# Altium schematic sheet Controller_Board_Main.SchDoc: Controller Board Main
size Tabloid; Author: Kevin Chen, Aleksa, Yifei Li; DrawnBy: Kevin Chen, Yifei Li; Engineer: Kevin Chen, Yifei Li; Revision: 4.0; SheetNumber: 1; SheetTotal: 2; PageSetup: Record=PageOptions|CenterHorizontal=True|CenterVertical=True|PrintScale=0.64|XCorrection=1.00|YCorrection=1.00|PrintKind=1|BorderSize=5000000|LeftOffset=0|BottomOffset=0|Orientation=2|PaperLength=1000|PaperWidth=1000|Scale=100|PaperSource=7|PrintQuality=-3|MediaType=1|DitherType=10|PrintScaleMode=1|PaperKind=Letter|PaperIndex=1; Website: www.uwmidsun.com
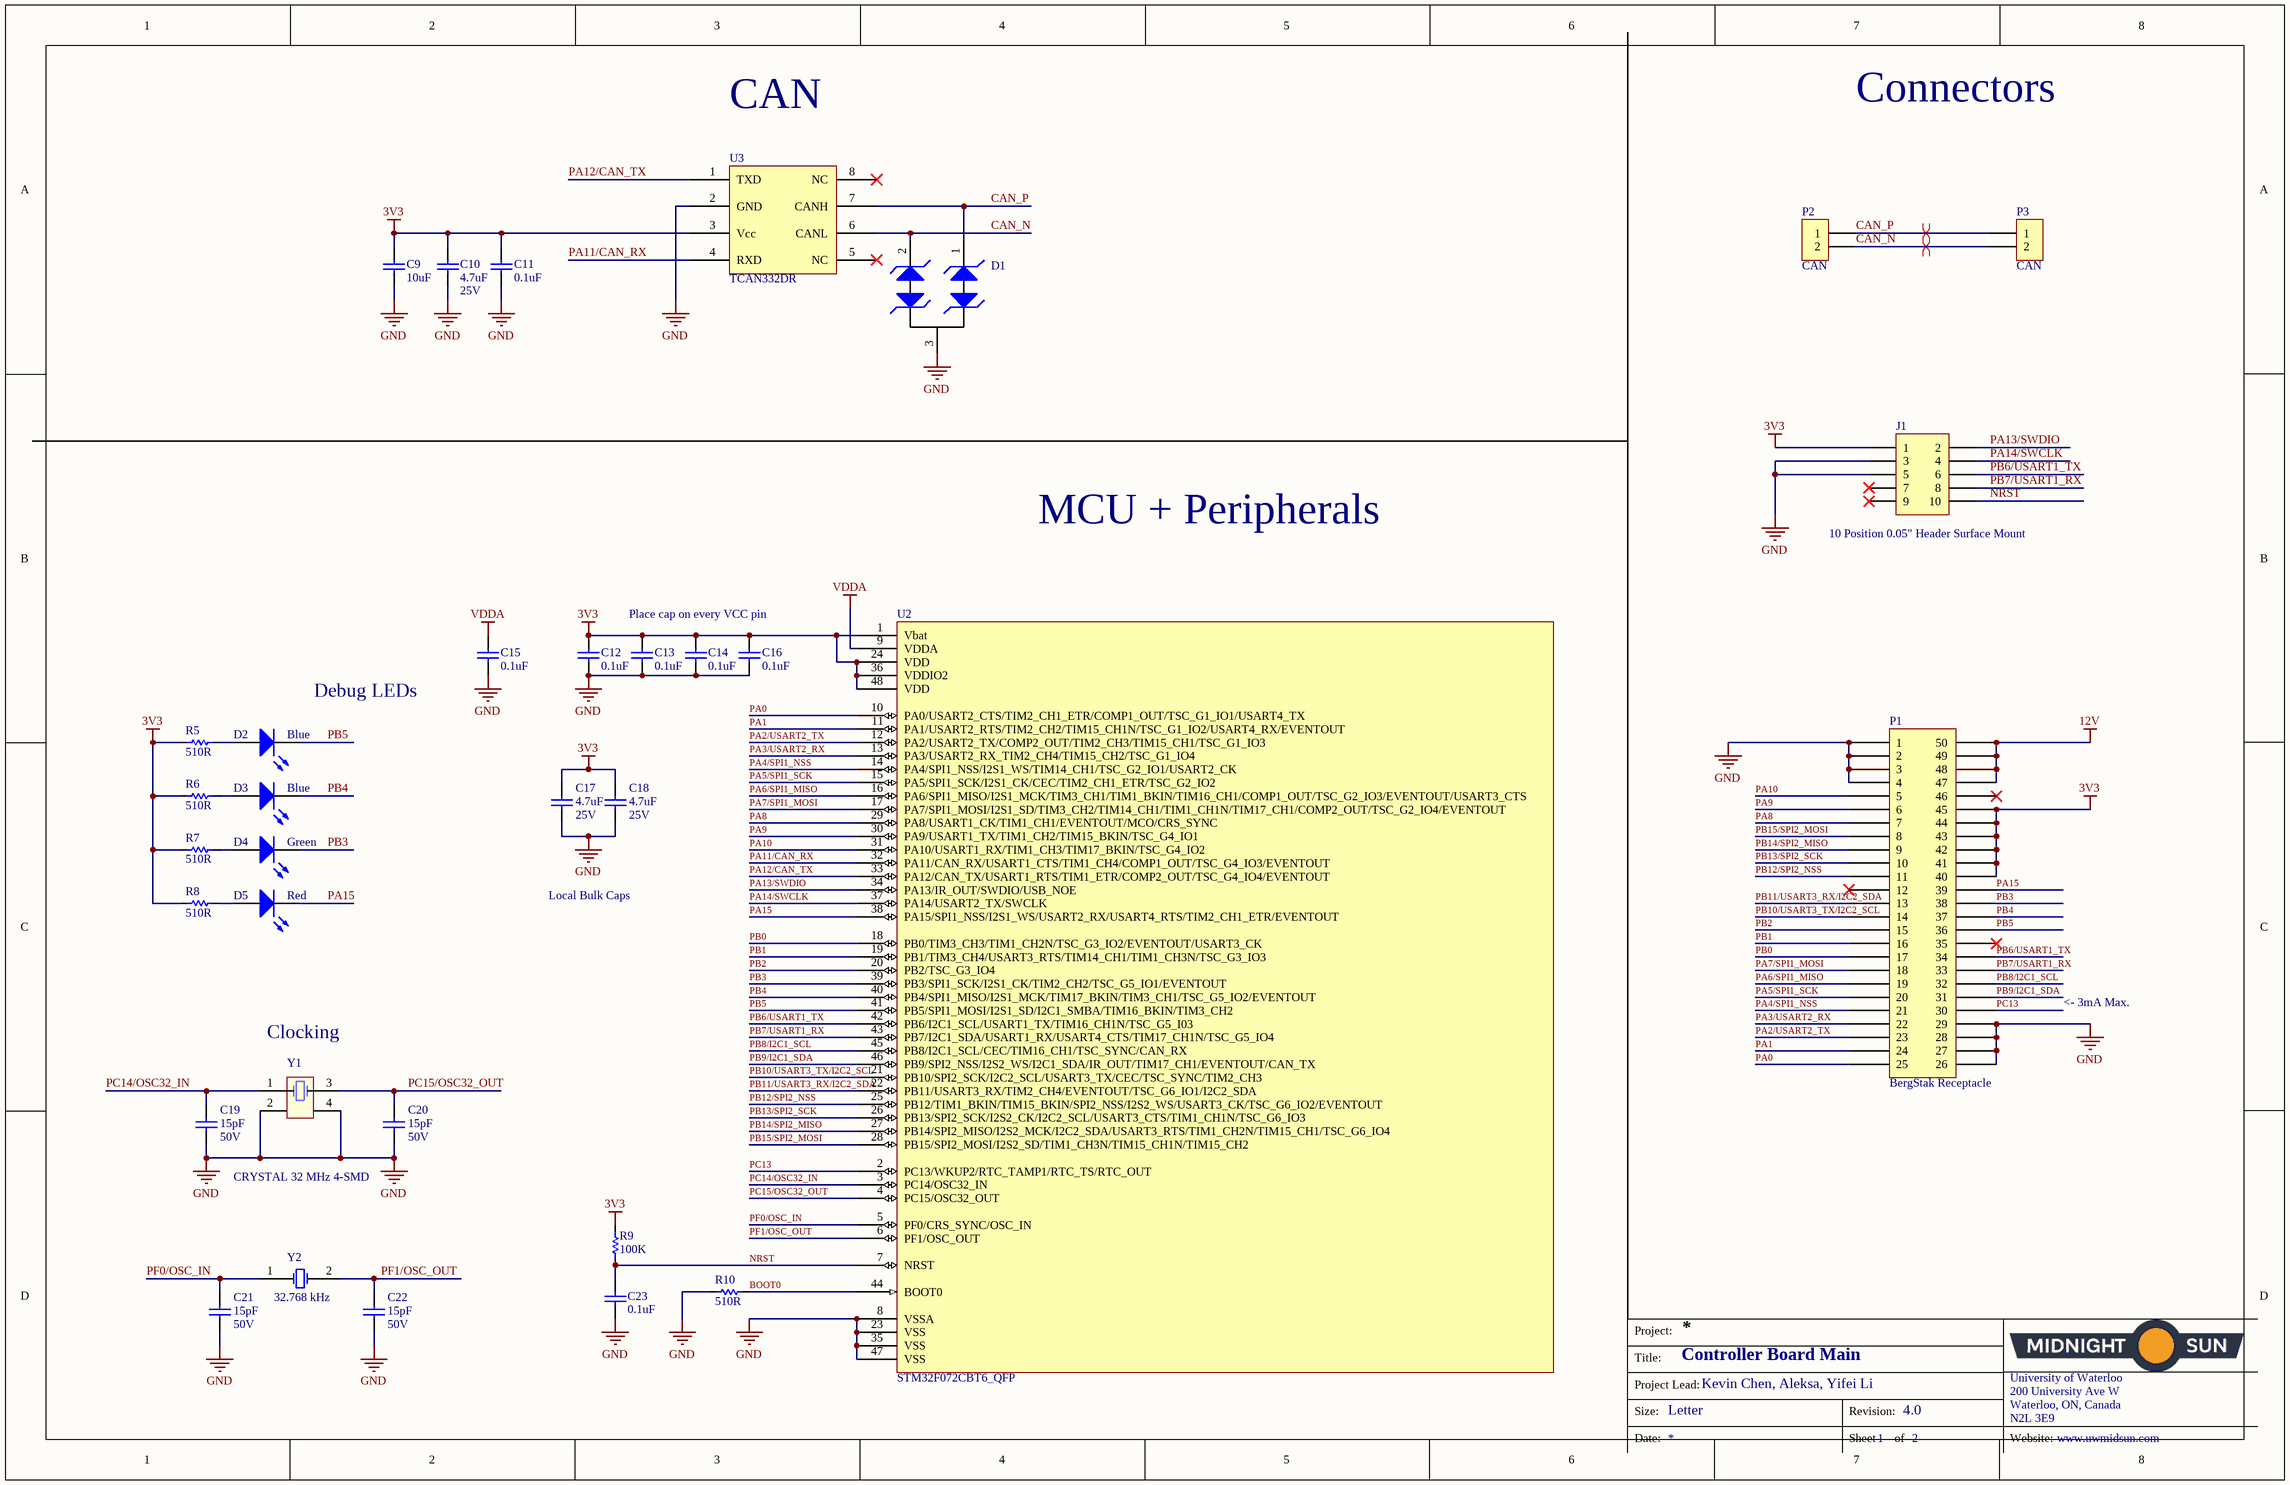
[diagram p0: Controller_Board_Main.SchDoc]

## Parts
C9  10uF  [CAPC1608X06N]
C10  4.7uF  Voltage: 25V  [CAPC1608X06N]
C11  0.1uF  [CAPC1608X06N]
C12  0.1uF  [CAPC1608X06N]
C13  0.1uF  [CAPC1608X06N]
C14  0.1uF  [CAPC1608X06N]
C15  0.1uF  [CAP, 0603]
C16  0.1uF  [CAPC1608X06N]
C17  4.7uF  Voltage: 25V  [CAPC1608X06N]
C18  4.7uF  Voltage: 25V  [CAPC1608X06N]
C19  15pF  Voltage: 50V  [CAPC1608X06N]
C20  15pF  Voltage: 50V  [CAPC1608X06N]
C21  15pF  Voltage: 50V  [CAPC1608X06N]
C22  15pF  Voltage: 50V  [CAPC1608X06N]
C23  0.1uF  [CAPC1608X06N]
D1  TVS Diode  [SOT23]  (value not drawn)
D2  Blue  [DIOC1608X06N]
D3  Blue  [DIOC1608X06N]
D4  Green  [DIOC1608X06N]
D5  Red  [DIOC1608X06N]
J1  10 Position 0.05" Header Surface Mount  [10 POS 1.27MM RECT CONN]
P1  BergStak Receptacle  [Bergstak 50 Pos Receptacle]
P2  CAN  [2 POS Dura-Click]
P3  CAN  [2 POS Dura-Click]
R5  510R  [RESC1608X06N]
R6  510R  [RESC1608X06N]
R7  510R  [RESC1608X06N]
R8  510R  [RESC1608X06N]
R9  100K  [RESC1608X06N]
R10  510R  [RESC1608X06N]
U2  STM32F072CBT6_QFP  [TSQFP50P890X890X160-48M]
U3  Manufacturer Part Number: TCAN332DR  [TSOP65P280X145-8N]  (hidden comment: TCAN332DR CAN Transceiver_SOT)
Y1  CRYSTAL 32 MHz 4-SMD  [CX2520DB CRYSTAL]
Y2  32.768 kHz  [ABS07AIG CRYSTAL]

## Nets
3V3: C9.2 C10.2 C11.2 C12.2 C13.2 C14.2 C16.2 C17.2 C18.2 J1.1 P1.40 P1.41 P1.42 P1.43 P1.44 P1.45 R5.1 R6.1 R7.1 R8.1 R9.2 U2.1(Vbat) U2.24(VDD) U2.36(VDDIO2) U2.48(VDD) U3.3(Vcc)
12V: P1.47 P1.48 P1.49 P1.50
GND: C9.1 C10.1 C11.1 C12.1 C13.1 C14.1 C15.1 C16.1 C17.1 C18.1 C19.1 C20.1 C21.1 C22.1 C23.1 D1.3(Common_Cathode) J1.3 J1.5 P1.1 P1.2 P1.3 P1.4 P1.26 P1.27 P1.28 P1.29 R10.1 U2.8(VSSA) U2.23(VSS) U2.35(VSS) U2.47(VSS) U3.2(GND) Y1.2 Y1.4
VDDA: C15.2 U2.9(VDDA)
BOOT0: R10.2 U2.44(BOOT0)
CAN_N: D1.2(Cathode2) P2.2 P3.2 U3.6(CANL)
CAN_P: D1.1(Cathode1) P2.1 P3.1 U3.7(CANH)
NRST: C23.2 J1.10 R9.1 U2.7(NRST)
PA0: P1.25 U2.10(PA0/USART2_CTS/TIM2_CH1_ETR/COMP1_OUT/TSC_G1_IO1/USART4_TX)
PA1: P1.24 U2.11(PA1/USART2_RTS/TIM2_CH2/TIM15_CH1N/TSC_G1_IO2/USART4_RX/EVENTOUT)
PA2/USART2_TX: P1.23 U2.12(PA2/USART2_TX/COMP2_OUT/TIM2_CH3/TIM15_CH1/TSC_G1_IO3)
PA3/USART2_RX: P1.22 U2.13(PA3/USART2_RX_TIM2_CH4/TIM15_CH2/TSC_G1_IO4)
PA4/SPI1_NSS: P1.21 U2.14(PA4/SPI1_NSS/I2S1_WS/TIM14_CH1/TSC_G2_IO1/USART2_CK)
PA5/SPI1_SCK: P1.20 U2.15(PA5/SPI1_SCK/I2S1_CK/CEC/TIM2_CH1_ETR/TSC_G2_IO2)
PA6/SPI1_MISO: P1.19 U2.16(PA6/SPI1_MISO/I2S1_MCK/TIM3_CH1/TIM1_BKIN/TIM16_CH1/COMP1_OUT/TSC_G2_IO3/EVENTOUT/USART3_CTS)
PA7/SPI1_MOSI: P1.18 U2.17(PA7/SPI1_MOSI/I2S1_SD/TIM3_CH2/TIM14_CH1/TIM1_CH1N/TIM17_CH1/COMP2_OUT/TSC_G2_IO4/EVENTOUT)
PA8: P1.7 U2.29(PA8/USART1_CK/TIM1_CH1/EVENTOUT/MCO/CRS_SYNC)
PA9: P1.6 U2.30(PA9/USART1_TX/TIM1_CH2/TIM15_BKIN/TSC_G4_IO1)
PA10: P1.5 U2.31(PA10/USART1_RX/TIM1_CH3/TIM17_BKIN/TSC_G4_IO2)
PA11/CAN_RX: U2.32(PA11/CAN_RX/USART1_CTS/TIM1_CH4/COMP1_OUT/TSC_G4_IO3/EVENTOUT) U3.4(RXD)
PA12/CAN_TX: U2.33(PA12/CAN_TX/USART1_RTS/TIM1_ETR/COMP2_OUT/TSC_G4_IO4/EVENTOUT) U3.1(TXD)
PA13/SWDIO: J1.2 U2.34(PA13/IR_OUT/SWDIO/USB_NOE)
PA14/SWCLK: J1.4 U2.37(PA14/USART2_TX/SWCLK)
PA15: D5.2(K) P1.39 U2.38(PA15/SPI1_NSS/I2S1_WS/USART2_RX/USART4_RTS/TIM2_CH1_ETR/EVENTOUT)
PB0: P1.17 U2.18(PB0/TIM3_CH3/TIM1_CH2N/TSC_G3_IO2/EVENTOUT/USART3_CK)
PB1: P1.16 U2.19(PB1/TIM3_CH4/USART3_RTS/TIM14_CH1/TIM1_CH3N/TSC_G3_IO3)
PB2: P1.15 U2.20(PB2/TSC_G3_IO4)
PB3: D4.2(K) P1.38 U2.39(PB3/SPI1_SCK/I2S1_CK/TIM2_CH2/TSC_G5_IO1/EVENTOUT)
PB4: D3.2(K) P1.37 U2.40(PB4/SPI1_MISO/I2S1_MCK/TIM17_BKIN/TIM3_CH1/TSC_G5_IO2/EVENTOUT)
PB5: D2.2(K) P1.36 U2.41(PB5/SPI1_MOSI/I2S1_SD/I2C1_SMBA/TIM16_BKIN/TIM3_CH2)
PB6/USART1_TX: J1.6 P1.34 U2.42(PB6/I2C1_SCL/USART1_TX/TIM16_CH1N/TSC_G5_I03)
PB7/USART1_RX: J1.8 P1.33 U2.43(PB7/I2C1_SDA/USART1_RX/USART4_CTS/TIM17_CH1N/TSC_G5_IO4)
PB8/I2C1_SCL: P1.32 U2.45(PB8/I2C1_SCL/CEC/TIM16_CH1/TSC_SYNC/CAN_RX)
PB9/I2C1_SDA: P1.31 U2.46(PB9/SPI2_NSS/I2S2_WS/I2C1_SDA/IR_OUT/TIM17_CH1/EVENTOUT/CAN_TX)
PB10/USART3_TX/I2C2_SCL: P1.14 U2.21(PB10/SPI2_SCK/I2C2_SCL/USART3_TX/CEC/TSC_SYNC/TIM2_CH3)
PB11/USART3_RX/I2C2_SDA: P1.13 U2.22(PB11/USART3_RX/TIM2_CH4/EVENTOUT/TSC_G6_IO1/I2C2_SDA)
PB12/SPI2_NSS: P1.11 U2.25(PB12/TIM1_BKIN/TIM15_BKIN/SPI2_NSS/I2S2_WS/USART3_CK/TSC_G6_IO2/EVENTOUT)
PB13/SPI2_SCK: P1.10 U2.26(PB13/SPI2_SCK/I2S2_CK/I2C2_SCL/USART3_CTS/TIM1_CH1N/TSC_G6_IO3)
PB14/SPI2_MISO: P1.9 U2.27(PB14/SPI2_MISO/I2S2_MCK/I2C2_SDA/USART3_RTS/TIM1_CH2N/TIM15_CH1/TSC_G6_IO4)
PB15/SPI2_MOSI: P1.8 U2.28(PB15/SPI2_MOSI/I2S2_SD/TIM1_CH3N/TIM15_CH1N/TIM15_CH2)
PC13: P1.30 U2.2(PC13/WKUP2/RTC_TAMP1/RTC_TS/RTC_OUT)
PC14/OSC32_IN: C19.2 U2.3(PC14/OSC32_IN) Y1.1(OSC1)
PC15/OSC32_OUT: C20.2 U2.4(PC15/OSC32_OUT) Y1.3(OSC2)
PF0/OSC_IN: C21.2 U2.5(PF0/CRS_SYNC/OSC_IN) Y2.1
PF1/OSC_OUT: C22.2 U2.6(PF1/OSC_OUT) Y2.2
NetD2_1: D2.1(A) R5.2
NetD3_1: D3.1(A) R6.2
NetD4_1: D4.1(A) R7.2
NetD5_1: D5.1(A) R8.2

Not connected (* = marked no-connect by the designer): J1 7* 9*; P1 12* 35* 46*; U3 5(NC)* 8(NC)*

## Layout directives
differential pair: CAN_N, CAN_P

## Notes on the sheet
- CAN
- Connectors
- MCU + Peripherals
- Place cap on every VCC pin
- Debug LEDs
- Local Bulk Caps
- <- 3mA Max.
- (near Y1) Clocking
- Project:
- Title:
- Size:
- Project Lead:
- Letter
- Revision:
- University of Waterloo
- 200 University Ave W
- Waterloo, ON, Canada
- N2L 3E9
- Date:
- Sheet
- of
- Website:

## Library data of the parts
C9 = CAP CER 10uF 25V 20% X5R 0603: 10µF ±20% 25V Ceramic Capacitor X5R 0603 (1608 Metric); Manufacturer: Murata Electronics North America; ManufacturerPartNumber: GRM188R61E106MA73D; Value: 10uF; Supplier: Digi-Key; SupplierPartNumber: 490-7202-1-ND; Voltage: 25V
C10 C17 C18 = CAP CER 4.7UF 25V 10% X5R 0603: 4.7µF ±10% 25V Ceramic Capacitor X5R 0603 (1608 Metric); Manufacturer: Murata Electronics North America; ManufacturerPartNumber: GRM188R61E475KE11D; Value: 4.7uF; Supplier: Digi-Key; SupplierPartNumber: 490-7203-1-ND
C11-C16 C23 = CAP CER 0.1UF 50V 10% X7R 0603: 0.10µF ±10% 50V Ceramic Capacitor X7R 0603 (1608 Metric); Manufacturer: AVX Corporation; ManufacturerPartNumber: 06035C104KAT2A; Value: 0.1uF; Supplier: Digi-Key; SupplierPartNumber: 478-5052-1-ND; Voltage: 50V
C19-C22 = CAP CER 15PF 50V NPO 0603: 15pF ±5% 50V Ceramic Capacitor C0G, NP0 0603 (1608 Metric); Manufacturer: Yageo; ManufacturerPartNumber: CC0603JRNPO9BN150; Value: 15pF; Supplier: Digi-Key; SupplierPartNumber: 311-1060-1-ND
D1 = TVS Diode: TVS DIODE 24VWM 70VC SOT23; Reverse_Standoff_Voltage: 24V; Supplier: Digikey; Supplier_PN: 568-4032-1-ND
D2 D3 = LED_BLUE: LED BLUE CLEAR 0603 SMD; Manufacturer: Lite-On Inc.; Manufacturer Part Number: LTST-C193TBKT-5A; Forward Voltage: 2.8V; DC Foward Current: 20mA; Digikey Part Number: 160-1827-1-ND; Color: Blue
D4 = LED_GREEN: LED GREEN CLEAR 0603 SMD; Manufacturer: Lite-On Inc.; Manufacturer Part Number: LTST-C193KGKT-5A; Forward Voltage: 2.0V; DC Forward Current: 30mA; Package: 0603; Color: Green; Supplier: Digi-Key; Supplier Part Number: 160-1828-1-ND
D5 = LED_RED: Red LED 0603; Manufacture: Lite-On Inc.; Manufacture Part Number: LTST-C191KRKT; Forward Voltage: 2.0V; DC Forward Current: 30mA; Package: 0603; Color: Red; Supplier: Digi-Key; Supplier Part Number: 160-1447-1-ND
J1 = 10 Position 0.05" Header Surface Mount: 10 Positions Header Connector 0.050" (1.27mm) Surface Mount Gold; Manufacturer: Amphenol FCI; Manufacturer Part Number: 20021121-00010C4LF; Supplier: Digikey; SupplierPartNumber: 609-3695-1-ND
P1 = BergStak 50 Position Connector Receptacle: 50 Position Connector Receptacle, Center Strip Contacts Surface Mount Gold; Manufacturer Part Number: 10132798-052100LF; Digikey Part Number: 609-5227-1-ND; Supplier 1: Digi-Key; Supplier Part Number 1: 609-5227-1-ND
P2 P3 = 2 Position DuraClik CAN Connector: 2 Positions Header, Shrouded Connector 0.079" (2.00mm) Surface Mount, Right Angle Tin; Manufacturer: Molex; Manufacturer Part Number: 5023520200; Supplier: Digi-Key; Supplier Part Number: WM7169CT-ND
R5-R8 R10 = RES 510 OHM 1/10W 0603 SMD: RES SMD 510 OHM 5% 1/10W 0603; ManufacturerPartNumber: RC0603JR-07510RL; Manufacturer: Yageo; Value: 510R; Supplier: Digi-Key; SupplierPartNumber: 311-510GRCT-ND
R9 = RES 100K OHM 1/8W 5% 0603 SMD: RES SMD 100K OHM 5% 1/10W 0603; ManufacturerPartNumber: RC0603JR-07100KL; Manufacturer: Yageo; Value: 100K; Supplier: Digi-Key; SupplierPartNumber: 311-100KGRCT-ND
U3 = TCAN332DR CAN Transceiver_SOT: 1/1 Transceiver CAN 8-SOIC; Digikey Part Number: 296-43711-1-ND; Supplier 1: Digi-Key; Supplier Part Number 1: 296-43711-1-ND
Y1 = CRYSTAL 32 MHz 4-SMD: 32MHz ±15ppm Crystal 8pF 50 Ohm -40°C ~ 85°C AEC-Q200 Surface Mount 4-SMD, No Lead; Manufacturer PN: CX2520DB32000D0GPSC1; Manfacturer: AVX Corp/Kyocera Corp; Supplier: Digikey; Supplier PN: 1253-1730-1-ND
Y2 = CRYSTAL 32.768KHZ 9PF 2-SMD: 32.768kHz ±20ppm Crystal 6pF 50 kOhm -40°C ~ 85°C Surface Mount 4-SOJ, 5.50mm pitch; Manufacturer Part Number: ABS07AIG-32.768KHZ-9-1-T; Supplier: Digi-Key; Supplier Part Number: 535-13353-1-ND; VALUE: 32.768 kHz
U2 = STM32F072CBT6_QFP: Digikey Part Number: 497-14645-ND; Supplier: Digi-Key; Supplier Part Number: 497-14645-ND; Manufacturer Part Number: STM32F072CBT6